# EAGLE design MONSTR_V0.2 (EAGLE 6.5.0)
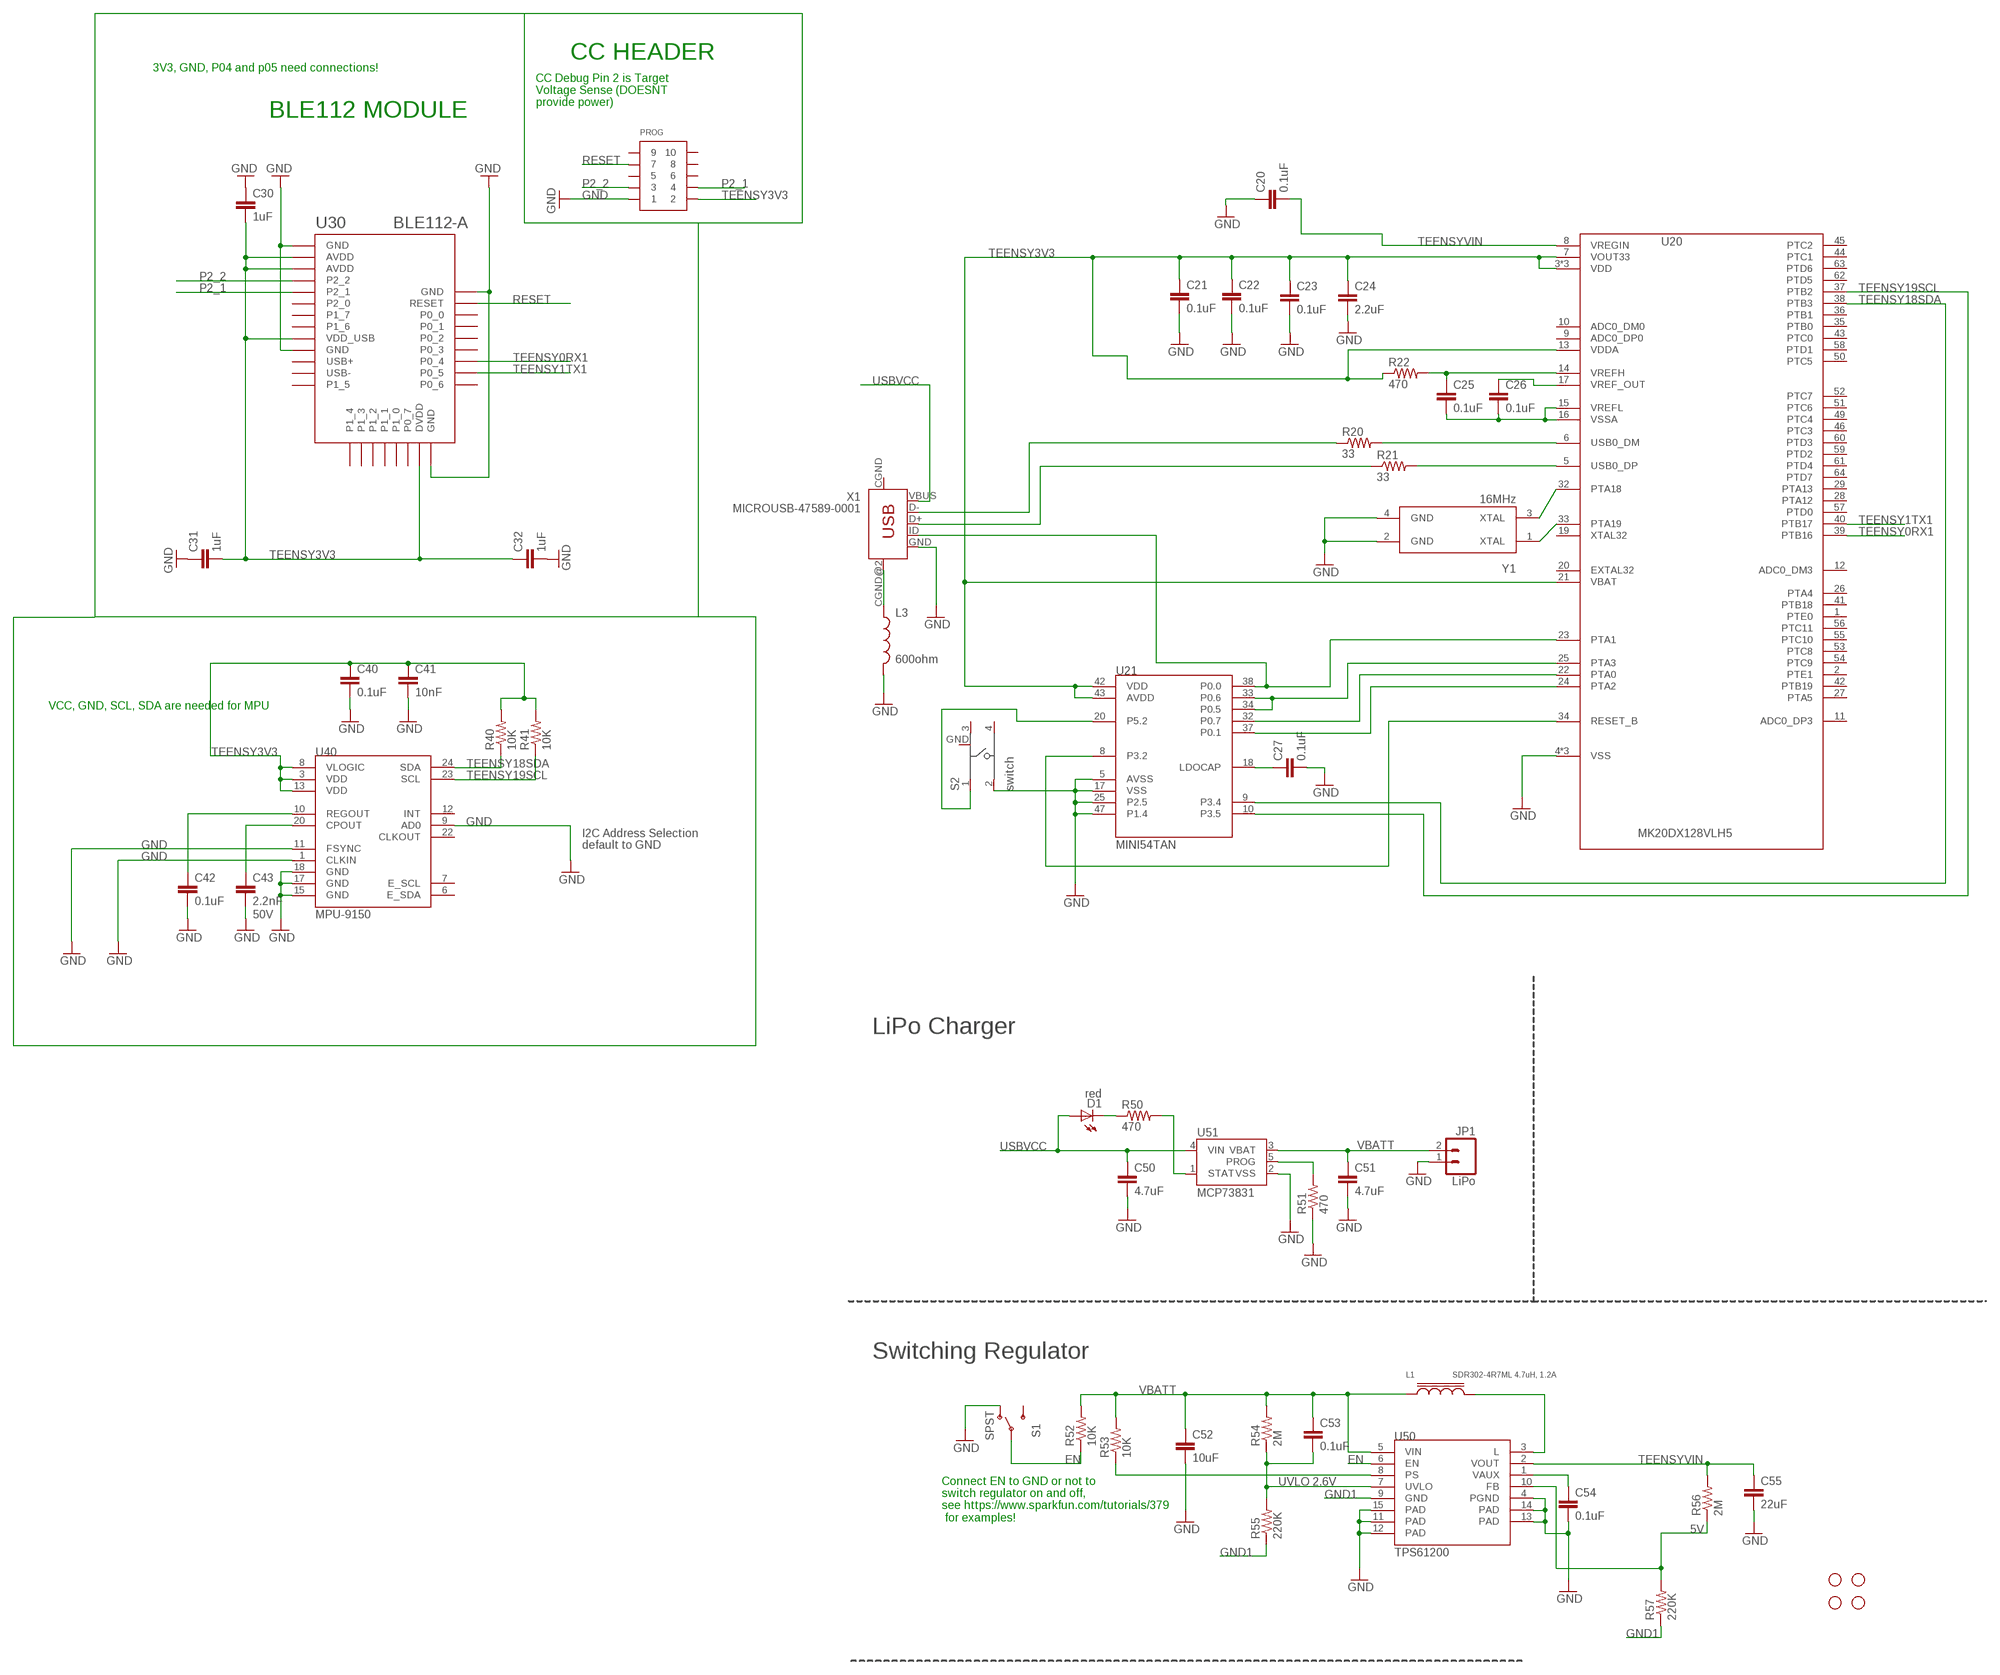
[diagram p0: schematic, sheet 1]

## Parts
C20  0.1uF  CAP0402-CAP  [0402-CAP]
C21  0.1uF  CAP0402-CAP  [0402-CAP]
C22  0.1uF  CAP0402-CAP  [0402-CAP]
C23  0.1uF  CAP0402-CAP  [0402-CAP]
C24  2.2uF  CAP0402-CAP  [0402-CAP]
C25  0.1uF  CAP0402-CAP  [0402-CAP]
C26  0.1uF  CAP0402-CAP  [0402-CAP]
C27  0.1uF  CAP0402-CAP  [0402-CAP]
C30  1uF  CAP0402-CAP  [0402-CAP]
C31  1uF  CAP0402-CAP  [0402-CAP]
C32  1uF  CAP0402-CAP  [0402-CAP]
C40  0.1uF  CAP0402-CAP  [0402-CAP]
C41  10nF  CAP0402-CAP  [0402-CAP]
C42  0.1uF  CAP0402-CAP  [0402-CAP]
C43  2.2nF  CAP0402-CAP  [0402-CAP]
C50  4.7uF  CAP0402-CAP  [0402-CAP]
C51  4.7uF  CAP0402-CAP  [0402-CAP]
C52  10uF  CAP0402-CAP  [0402-CAP]
C53  0.1uF  CAP0402-CAP  [0402-CAP]
C54  0.1uF  CAP0402-CAP  [0402-CAP]
C55  22uF  CAP0603-CAP  [0603-CAP]
D1  red  LED0603  [LED-0603]
JP1  LiPo  M02-JST-2MM-SMT  [JST-2-SMD]
JP7  STAND-OFF  [STAND-OFF]
JP8  STAND-OFF  [STAND-OFF]
JP9  STAND-OFF  [STAND-OFF]
JP10  STAND-OFF  [STAND-OFF]
L1  SDR302-4R7ML 4.7uH, 1.2A  BOURNE-SDR302-SERIES-INDUCTOR  [BOURNS-SDR0302-SERIES-INDUCTOR]
L3  600ohm  INDUCTOR0805  [0805]
PROG  CONN_5-2-FTSH-V  [FTSH-105-DV]
R20  33  RESISTOR0402-RES  [0402-RES]
R21  33  RESISTOR0402-RES  [0402-RES]
R22  470  RESISTOR0402-RES  [0402-RES]
R40  10K  RESISTOR0402-RES  [0402-RES]
R41  10K  RESISTOR0402-RES  [0402-RES]
R50  470  RESISTOR0402-RES  [0402-RES]
R51  470  RESISTOR0402-RES  [0402-RES]
R52  10K  RESISTOR0402-RES  [0402-RES]
R53  10K  RESISTOR0402-RES  [0402-RES]
R54  2M  RESISTOR0402-RES  [0402-RES]
R55  220K  RESISTOR0402-RES  [0402-RES]
R56  2M  RESISTOR0402-RES  [0402-RES]
R57  220K  RESISTOR0402-RES  [0402-RES]
S1  SPST  SWITCH-SPDT-SMD-A  [SWITCH-SPST-SMD-A]
S2  switch  101-IG  [101-IG]
U20  MK20DX128VLH5  [MK20DX128VLH5]
U21  MINI54TAN  [MINI54TAN]
U30  BLE112-A  BLE112-A-VISUAL  [BLE112-A]
U40  MPU-9150  MPU-9150QFN-24-NP  [QFN-24-NP]
U50  TPS61200  [QFN-10_PAD]
U51  MCP73831  [SOT23-5]
X1  MICROUSB-47589-0001  [MICROUSB-47589-0001]
Y1  16MHz  NX3225SA  [CRYSTAL-SMD-3.2_2.5MM]

## Nets
5V: R56.1 R57.2 U50.10(FB)
EN: R52.1 S1.2(P) U50.6(EN)
GND: C20.1 C21.2 C22.2 C23.2 C24.2 C27.2 C30.1 C31.1 C32.2 C40.2 C41.2 C42.2 C43.2 C50.2 C51.2 C52.2 C54.2 C55.2 JP1.1 L3.2 PROG.1 R51.1 S1.1(O) S2.2 U20.4(VSS) U20.31(VSS) U20.47(VSS) U21.5(AVSS) U21.17(VSS) U21.25(P2.5) U21.47(P1.4) U30.GND1(GND) U30.GND2(GND) U30.GND3(GND) U30.GND4(GND) U40.1(CLKIN) U40.9(AD0) U40.11(FSYNC) U40.15(GND) U40.17(GND) U40.18(GND) U50.4(PGND) U50.11(PAD) U50.12(PAD) U50.13(PAD) U50.14(PAD) U50.15(PAD) U51.2(VSS) X1.GND Y1.2(GND) Y1.4(GND)
GND1: R55.1 R57.1 U50.9(GND)
N$1: C43.1 U40.20(CPOUT)
N$2: C42.1 U40.10(REGOUT)
N$4: R53.1 U50.8(PS)
N$5: R51.2 U51.5(PROG)
N$6: R50.2 U51.1(STAT)
N$7: U20.32(PTA18) Y1.3(XTAL)
N$8: U20.33(PTA19) Y1.1(XTAL)
N$15: C25.2 C26.2 U20.15(VREFL) U20.16(VSSA)
N$16: R20.2 U20.6(USB0_DM)
N$17: R21.2 U20.5(USB0_DP)
N$18: R20.1 X1.D-
N$19: R21.1 X1.D+
N$20: L3.1 X1.CGND@2(MTN4)
N$21: C26.1 U20.17(VREF_OUT)
N$22: C25.1 R22.2 U20.14(VREFH)
N$26: U20.23(PTA1) U21.38(P0.0) X1.ID
N$27: U20.25(PTA3) U21.33(P0.6) U21.34(P0.5)
N$28: U20.22(PTA0) U21.32(P0.7)
N$29: U20.24(PTA2) U21.37(P0.1)
N$32: S2.1 U21.20(P5.2)
N$33: U20.34(RESET_B) U21.8(P3.2)
N$54: C27.1 U21.18(LDOCAP)
N$56: D1.C R50.1
N$57: L1.2 U50.3(L)
N$58: C54.1 U50.1(VAUX)
P2_1: PROG.4 U30.P2_1
P2_2: PROG.3 U30.P2_2
RESET: PROG.7 U30.RESET
TEENSY0RX1: U20.39(PTB16) U30.P0_4
TEENSY1TX1: U20.40(PTB17) U30.P0_5
TEENSY3V3 [power]: C21.1 C22.1 C23.1 C24.1 C30.2 C31.2 C32.1 C40.1 C41.1 PROG.2 R22.1 R40.2 R41.2 U20.3(VDD) U20.7(VOUT33) U20.13(VDDA) U20.21(VBAT) U20.30(VDD) U20.48(VDD) U21.42(VDD) U21.43(AVDD) U30.AVDD1(AVDD) U30.AVDD2(AVDD) U30.DVDD U30.VDD_USB U40.3(VDD) U40.8(VLOGIC) U40.13(VDD)
TEENSY18SDA: R40.1 U20.38(PTB3) U21.9(P3.4) U40.24(SDA)
TEENSY19SCL: R41.1 U20.37(PTB2) U21.10(P3.5) U40.23(SCL)
TEENSYVIN: C20.2 C55.1 R56.2 U20.8(VREGIN) U50.2(VOUT)
USBVCC: C50.1 D1.A U51.4(VIN) X1.VBUS
UVLO: C53.2 R54.1 R55.2 U50.7(UVLO)
VBATT: C51.1 C52.1 C53.1 JP1.2 L1.1 R52.2 R53.2 R54.2 U50.5(VIN) U51.3(VBAT)
Unconnected: PROG.5 PROG.6 PROG.8 PROG.9 PROG.10 S1.3(S) S2.3 S2.4 U20.1(PTE0) U20.2(PTE1) U20.9(ADC0_DP0) U20.10(ADC0_DM0) U20.11(ADC0_DP3) U20.12(ADC0_DM3) U20.19(XTAL32) U20.20(EXTAL32) U20.26(PTA4) U20.27(PTA5) U20.28(PTA12) U20.29(PTA13) U20.35(PTB0) U20.36(PTB1) U20.41(PTB18) U20.42(PTB19) U20.43(PTC0) U20.44(PTC1) U20.45(PTC2) U20.46(PTC3) U20.49(PTC4) U20.50(PTC5) U20.51(PTC6) U20.52(PTC7) U20.53(PTC8) U20.54(PTC9) U20.55(PTC10) U20.56(PTC11) U20.57(PTD0) U20.58(PTD1) U20.59(PTD2) U20.60(PTD3) U20.61(PTD4) U20.62(PTD5) U20.63(PTD6) U20.64(PTD7) U30.P0_0 U30.P0_1 U30.P0_2 U30.P0_3 U30.P0_6 U30.P0_7 U30.P1_0 U30.P1_1 U30.P1_2 U30.P1_3 U30.P1_4 U30.P1_5 U30.P1_6 U30.P1_7 U30.P2_0 U30.USB+ U30.USB- U40.6(E_SDA) U40.7(E_SCL) U40.12(INT) U40.22(CLKOUT) X1.CGND(MTN2)

## Notes on the sheet
- CC HEADER
- 3V3, GND, P04 and p05 need connections!
- CC Debug Pin 2 is Target
  Voltage Sense (DOESNT
  provide power)
- BLE112 MODULE
- VCC, GND, SCL, SDA are needed for MPU
- I2C Address Selection
- default to GND
- 50V
- LiPo Charger
- Switching Regulator
- UVLO 2.6V
- Connect EN to GND or not to 
  switch regulator on and off, 
  see https://www.sparkfun.com/tutorials/379
   for examples!

## Power pins joined to a net without a drawn wire
GND: S2.GND

## Library data of the parts
C20-C27 C30-C32 C40-C43 C50-C55 = SparkFun-Capacitors:CAP: Capacitor Standard 0603 ceramic capacitor, and 0.1" leaded capacitor.
D1 = SparkFun-LED:LED: LEDs Standard schematic elements and footprints for 5mm, 3mm, 1206, and 0603 sized LEDs. 5mm - Spark Fun Electronics SKU : COM-00529 (and others)
JP1 = SparkFun:M02: Header 2 Standard 2-pin 0.1" header. Use with straight break away headers (SKU : PRT-00116), right angle break away headers (PRT-00553), swiss pins (PRT-00743), machine pins (PRT-00117), and female headers (PRT-00115). Molex polarized connector foot print use with SKU : PRT-08233 with associated crimp pins and housings.
JP7-JP10 = SparkFun:STAND-OFF: Stand Off This is the mechanical footprint for a #4 phillips button head screw. Use the keepout ring to avoid running the screw head into surrounding components. SKU : PRT-00447
L1 = BenLibrary:BOURNE-SDR302-SERIES-INDUCTOR: Bourne SDR0302 Series ferrite-core inductor http://www.digikey.com/product-detail/en/SDR0302-4R7ML/SDR0302-4R7MLCT-ND/2127073
L3 = SparkFun-Passives:INDUCTOR: Inductors Basic Inductor/Choke - 0603 and 1206. Footprints are not proven and vary greatly between part numbers. SRN6045- 33uH, 20% 1.4A SDR0403-560KL - 56uH, 10%, 500mA RMS/740mA peak
PROG = pel_misc:CONN_5-2
R20-R22 R40 R41 R50-R57 = SparkFun-Passives:RESISTOR: Resistor Basic schematic elements and footprints for 0603, 1206, and PTH resistors.
S1 = SparkFun-Electromechanical:SWITCH-SPDT: SPDT Switch Simple slide switch, Spark Fun Electronics SKU : COM-00102 DPDT SMT slide switch, AYZ0202, SWCH-08179
S2 = BLE112 Breakout Board v2.1-non-prefixed:101-IG
U20 = TeensyCustom:MK20DX128VLH5: Teensy 3.0 Processing Unit - MK20DX128VLH5 ARM Cortex M0 Datasheet: http://cache.freescale.com/files/32bit/doc/data_sheet/K20P64M50SF0.pdf
U21 = TeensyCustom:MINI54TAN: MINI54TAN Bootloader from PJRC.com, preprogrammed with Teensy 3.0 bootloader. https://www.pjrc.com/store/ic_mini54_tqfp.html
U30 = sf-bluegiga:BLE112-A-VISUAL: Bluetooth Low Energy single-mode module - Bluetooth 4.0, chip antenna
U40 = SparkFun-Sensors:MPU-9150: 9DOF (3mag, 3accel, 3rotat). I2C interface.
U50 = SparkFun:TPS61200: DC to DC Booster
U51 = SparkFun:MCP73831: Microchip's MCP73831 Miniature single cell, fully integrated Li-Ion, Li-polymer charge management controller http://ww1.microchip.com/downloads/en/DeviceDoc/21984a.pdf
X1 = BLE112 Breakout Board v2.1-non-prefixed:MICROUSB-47589-0001
Y1 = BenLibrary:NX3225SA: 16MHz, 10PF SMD Crystal, NX3225SA http://www.digikey.com/product-detail/en/NX3225SA-16.000000MHZ-T1/644-1100-2-ND

## Net classes
1 power: width 0.254 mm, drill 0.33 mm, clearance 0.152 mm

## Board
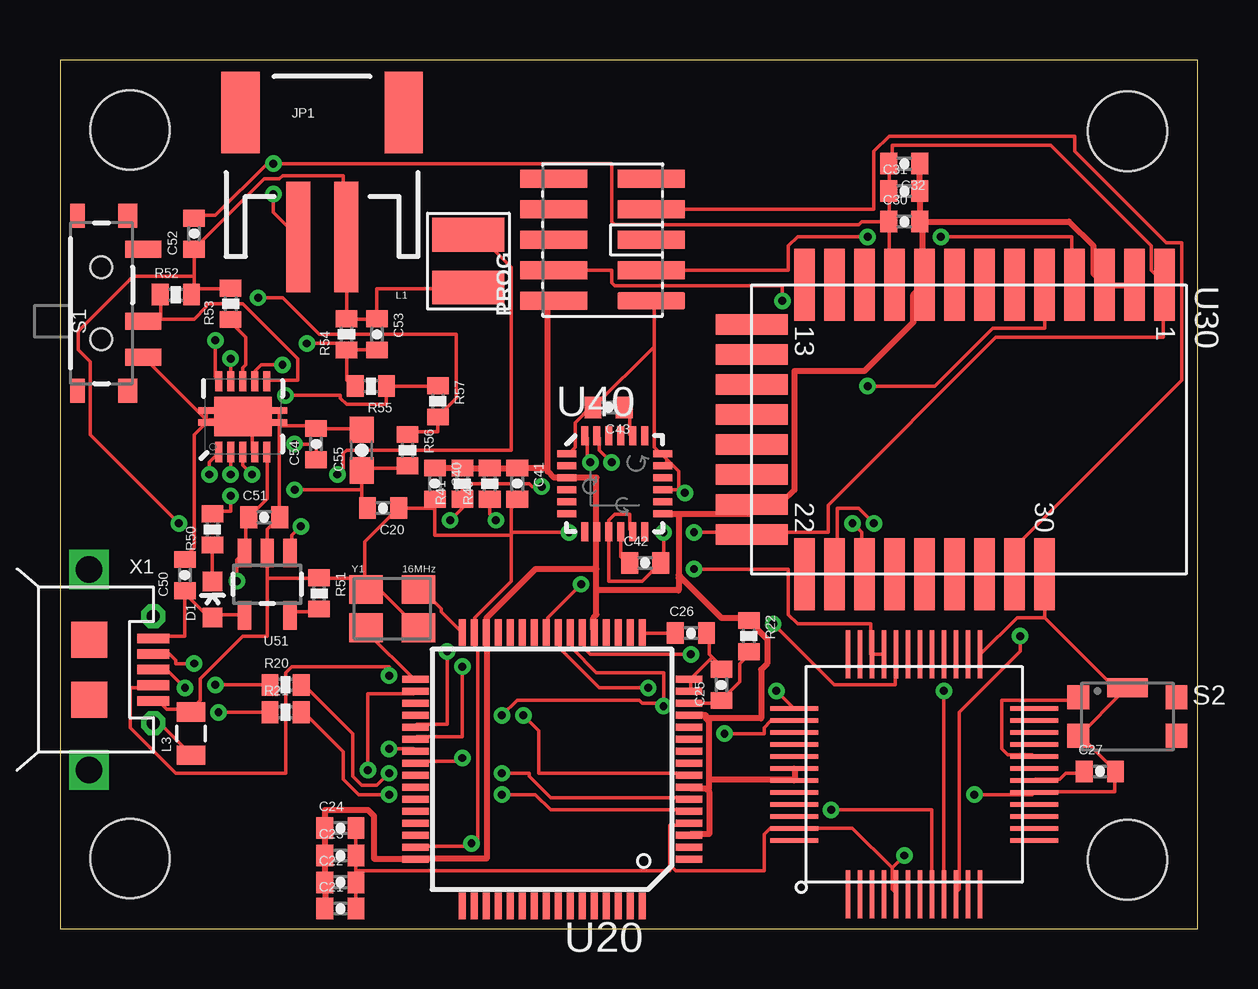
[diagram p1: board, top side]
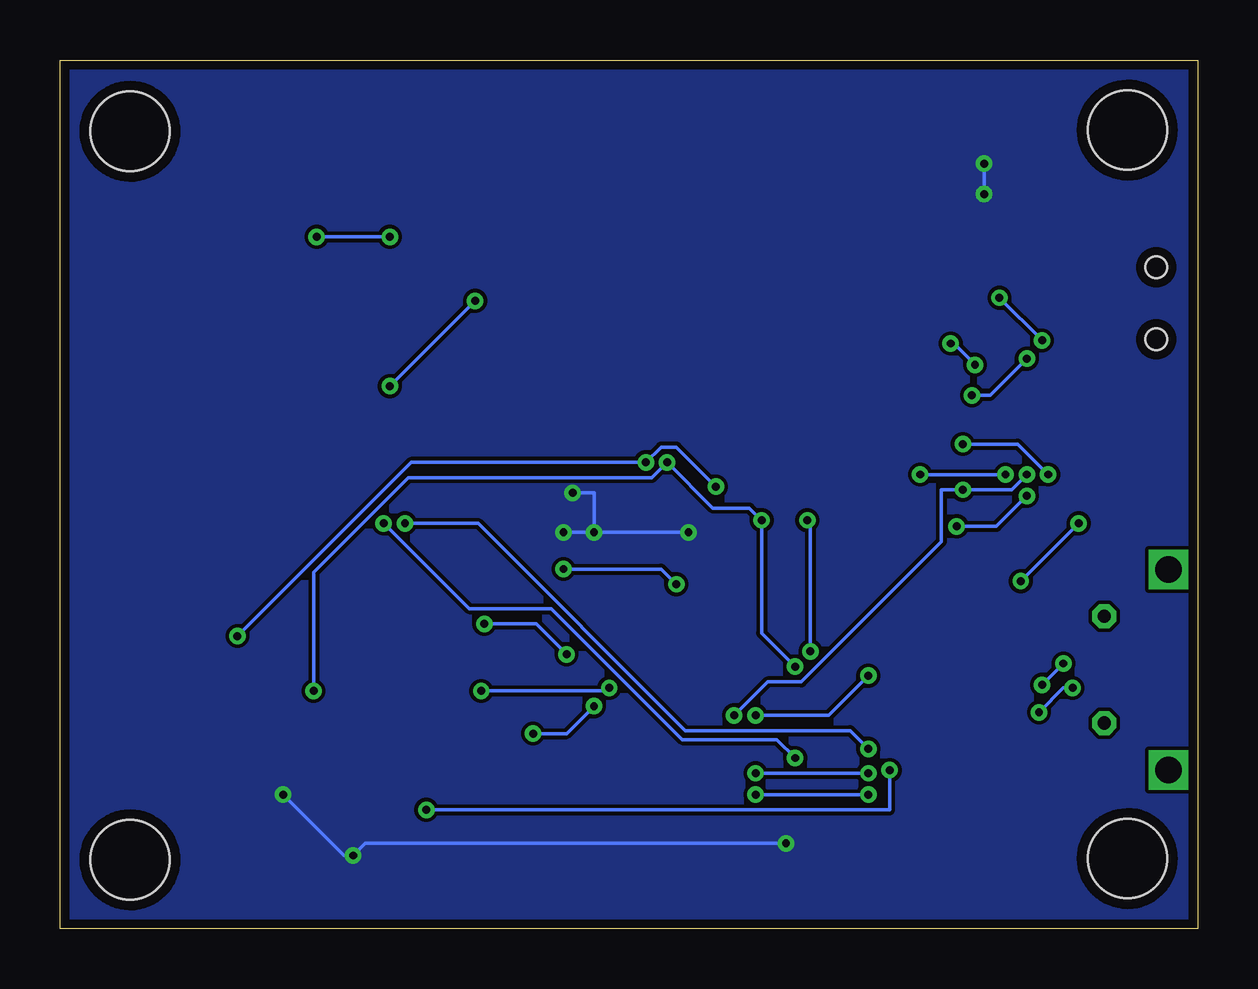
[diagram p2: board, bottom side, seen from below]

Size 47.4 x 36.2 mm. Coordinates in mm from the lower left corner, seen from the top.
Outline: 0,0 47.4,0 47.4,36.2 0,36.2 0,0
Copper layers (1*16): Top 0.0356mm / dielectric 1.5011mm / Bottom 0.0356mm
Design rules "LaenPCBOrder": minimum track width 6mil, minimum drill 13mil, track to track 6mil, track to pad 6mil, pad to pad 6mil, via to via 6mil, smd to smd 6mil, copper to edge 15mil, drill to drill 6mil, minimum pad ring 7mil, minimum via ring 7mil, stop-mask expansion 4mil, vias tented up to drill 0mil, thermal gap 10mil

### Footprints (pad centres in the part's own frame; a part is rotated, then mirrored left to right if it is on the bottom)
0402-CAP = smd 0.7 x 0.9: 1 -0.65,0; 2 0.65,0
0603-CAP = smd 1.1 x 1: 1 -0.85,0; 2 0.85,0
LED-0603 = smd 0.8 x 0.8: A 0,-0.75; C 0,0.75
JST-2-SMD = smd 1 x 4.6: 1 -1,-3.7; 2 1,-3.7 | smd 1.6 x 3.4: NC1 -3.4,1.5; NC2 3.4,1.5
STAND-OFF = hole 3.302: 0,0
BOURNS-SDR0302-SERIES-INDUCTOR = smd 3 x 1.4: 1 0,1.1; 2 0,-1.1
0805 = smd 0.8 x 1.2: 1 -0.9,0; 2 0.9,0
FTSH-105-DV = smd 0.74 x 2.8: 1 -2.54,-2.03; 2 -2.54,2.03; 3 -1.27,-2.03; 4 -1.27,2.03; 5 0,-2.03; 6 0,2.03; 7 1.27,-2.03; 8 1.27,2.03; 9 2.54,-2.03; 10 2.54,2.03
0402-RES = smd 0.7 x 0.9: 1 -0.65,0; 2 0.65,0
SWITCH-SPST-SMD-A = smd 0.7 x 1.5: 1 -2.25,-1.75; 2 -0.75,-1.75; 3 2.25,-1.75 | smd 1 x 0.6: GND1 -3.65,1; GND3 3.65,1 | smd 1 x 0.8: GND2 -3.65,-1.1; GND4 3.65,-1.1 | hole 0.9: -1.5,0; 1.5,0
101-IG = smd 0.9 x 1: 1 -2.05,0.8; 2 -2.05,-0.8; 3 2.05,0.8; 4 2.05,-0.8 | smd 1.7 x 0.8: GND 0,1.2
MK20DX128VLH5 = smd 1.1 x 0.285: 1 -5.605,3.385; 2 -5.605,2.885; 3 -5.605,2.385; 4 -5.605,1.885; 5 -5.605,1.385; 6 -5.605,0.885; 7 -5.605,0.385; 8 -5.605,-0.115; 9 -5.605,-0.615; 10 -5.605,-1.115; 11 -5.605,-1.615; 12 -5.605,-2.115; 13 -5.605,-2.615; 14 -5.605,-3.115; 15 -5.605,-3.615; 16 -5.605,-4.115; 33 5.795,-4.115; 34 5.795,-3.615; 35 5.795,-3.115; 36 5.795,-2.615; 37 5.795,-2.115; 38 5.795,-1.615; 39 5.795,-1.115; 40 5.795,-0.615; 41 5.795,-0.115; 42 5.795,0.385; 43 5.795,0.885; 44 5.795,1.385; 45 5.795,1.885; 46 5.795,2.385; 47 5.795,2.885; 48 5.795,3.385 | smd 0.285 x 1.1: 17 -3.655,-6.065; 18 -3.155,-6.065; 19 -2.655,-6.065; 20 -2.155,-6.065; 21 -1.655,-6.065; 22 -1.155,-6.065; 23 -0.655,-6.065; 24 -0.155,-6.065; 25 0.345,-6.065; 26 0.845,-6.065; 27 1.345,-6.065; 28 1.845,-6.065; 29 2.345,-6.065; 30 2.845,-6.065; 31 3.345,-6.065; 32 3.845,-6.065; 49 3.845,5.335; 50 3.345,5.335; 51 2.845,5.335; 52 2.345,5.335; 53 1.845,5.335; 54 1.345,5.335; 55 0.845,5.335; 56 0.345,5.335; 57 -0.155,5.335; 58 -0.655,5.335; 59 -1.155,5.335; 60 -1.655,5.335; 61 -2.155,5.335; 62 -2.655,5.335; 63 -3.155,5.335; 64 -3.655,5.335
MINI54TAN = smd 0.2 x 2: 1 -2.75,-5; 2 -2.25,-5; 3 -1.75,-5; 4 -1.25,-5; 5 -0.75,-5; 6 -0.25,-5; 7 0.25,-5; 8 0.75,-5; 9 1.25,-5; 10 1.75,-5; 11 2.25,-5; 12 2.75,-5; 25 2.75,5; 26 2.25,5; 27 1.75,5; 28 1.25,5; 29 0.75,5; 30 0.25,5; 31 -0.25,5; 32 -0.75,5; 33 -1.25,5; 34 -1.75,5; 35 -2.25,5; 36 -2.75,5 | smd 2 x 0.2: 13 5,-2.75; 14 5,-2.25; 15 5,-1.75; 16 5,-1.25; 17 5,-0.75; 18 5,-0.25; 19 5,0.25; 20 5,0.75; 21 5,1.25; 22 5,1.75; 23 5,2.25; 24 5,2.75; 37 -5,2.75; 38 -5,2.25; 39 -5,1.75; 40 -5,1.25; 41 -5,0.75; 42 -5,0.25; 43 -5,-0.25; 44 -5,-0.75; 45 -5,-1.25; 46 -5,-1.75; 47 -5,-2.25; 48 -5,-2.75
BLE112-A = smd 3 x 0.85: AVDD1 -6.05,6.9; AVDD2 -6.05,5.65; GND1 -6.05,8.15; GND2 -6.05,-3.1; GND4 6,3.15; P0_0 6,0.65; P0_1 6,-0.6; P0_2 6,-1.85; P0_3 6,-3.1; P0_4 6,-4.35; P0_5 6,-5.6; P0_6 6,-6.85; P1_5 -6.05,-6.85; P1_6 -6.05,-0.6; P1_7 -6.05,0.65; P2_0 -6.05,1.9; P2_1 -6.05,3.15; P2_2 -6.05,4.4; RESET 6,1.9; USB+ -6.05,-4.35; USB- -6.05,-5.6; VDD_USB -6.05,-1.85 | smd 0.85 x 3: DVDD 3.1,-9.05; GND3 4.35,-9.05; P0_7 1.85,-9.05; P1_0 0.6,-9.05; P1_1 -0.65,-9.05; P1_2 -1.9,-9.05; P1_3 -3.15,-9.05; P1_4 -4.4,-9.05
QFN-24-NP = smd 0.8 x 0.3: 1 -2,1.25; 2 -2,0.75; 3 -2,0.25; 4 -2,-0.25; 5 -2,-0.75; 6 -2,-1.25; 13 2,-1.25; 14 2,-0.75; 15 2,-0.25; 16 2,0.25; 17 2,0.75; 18 2,1.25 | smd 0.3 x 0.8: 7 -1.25,-2; 8 -0.75,-2; 9 -0.25,-2; 10 0.25,-2; 11 0.75,-2; 12 1.25,-2; 19 1.25,2; 20 0.75,2; 21 0.25,2; 22 -0.25,2; 23 -0.75,2; 24 -1.25,2
QFN-10_PAD = smd 0.297 x 0.85: 1 -1,-1.475; 2 -0.5,-1.475; 3 0,-1.475; 4 0.5,-1.475; 5 1,-1.475; 6 1,1.475; 7 0.5,1.475; 8 0,1.475; 9 -0.5,1.475; 10 -1,1.475 | smd 0.7 x 0.28: 11 -1.5,0.25; 12 -1.5,-0.25; 13 1.5,0.25; 14 1.5,-0.25 | smd 2.4 x 1.65: 15 0,0
SOT23-5 = smd 0.55 x 1.2: 1 -0.95,-1.3; 2 0,-1.3; 3 0.95,-1.3; 4 0.95,1.3; 5 -0.95,1.3
MICROUSB-47589-0001 = drill 0.55 pad 1 octagon: CGND 0,2.225; CGND@2 0,-2.225 | drill 1.1 pad 1.6 square: CGND@3 -2.675,-4.175; CGND@4 -2.675,4.175 | smd 1.5 x 1.5: CGND@5 -2.675,1.25; CGND@6 -2.675,-1.25 | smd 1.35 x 0.4: D+ 0,0; D- 0,0.65; GND 0,-1.3; ID 0,-0.65; VBUS 0,1.3
CRYSTAL-SMD-3.2_2.5MM = smd 1.4 x 1.2: 1 -1.1,-0.8; 2 1.1,-0.8; 3 1.1,0.8; 4 -1.1,0.8

### Placement (x,y rotation side)
C20  13.46,17.53 180 top
C21  11.68,0.84 0 top
C22  11.68,1.93 0 top
C23  11.68,3.05 0 top
C24  11.68,4.19 0 top
C25  27.56,10.16 90 top
C26  26.29,12.32 0 top
C27  43.33,6.55 0 top
C30  35.18,29.46 0 top
C31  35.18,30.73 0 top
C32  35.18,31.88 180 top
C40  15.62,18.54 270 top
C41  19.05,18.54 270 top
C42  24.38,15.24 0 top
C43  22.86,21.72 180 top
C50  5.21,14.73 90 top
C51  8.51,17.14 0 top
C52  5.59,28.96 90 top
C53  13.21,24.77 270 top
C54  10.67,20.19 90 top
C55  12.57,19.94 90 top
D1  6.35,13.72 0 top
JP1  10.92,32.51 0 top
JP7  44.48,2.87 0 top
JP8  44.48,33.22 0 top
JP9  2.92,33.27 0 top
JP10  2.92,2.92 0 top
L1  17.02,27.81 180 top
L3  5.46,8.13 90 top
PROG  22.61,28.7 90 top
R20  9.4,10.16 0 top
R21  9.4,9.02 0 top
R22  28.7,12.19 270 top
R40  17.91,18.54 90 top
R41  16.76,18.54 90 top
R50  6.35,16.64 90 top
R51  10.79,13.97 270 top
R52  4.83,26.42 0 top
R53  7.11,26.04 90 top
R54  11.94,24.77 90 top
R55  12.95,22.61 180 top
R56  14.48,19.94 270 top
R57  15.75,21.97 270 top
S1  1.73,26.06 90 top
S2  44.48,8.84 0 top
U20  20.6,6.27 180 top
U21  35.59,6.43 0 top
U30  37.87,20.78 270 top
U40  23.11,18.54 0 top
U50  7.62,21.34 0 top
U51  8.64,14.35 180 top
X1  3.89,10.79 0 top
Y1  13.84,13.34 0 top

### Tracks (layer width: path | path; a pad name or v marks a point on that pad's centre or on a via)
5V  (via drill 0.33)
  Top 0.152: v6.48,24.51 6.48,22.99 6.6,22.86 U50.10 | v8.26,26.29 9.27,26.29 10.79,24.77 16.51,24.77 16.51,22.1 15.75,21.34 R57.2 15.75,20.7 14.48,20.7 R56.1
  Bottom 0.152: v8.26,26.29 v6.48,24.51
EN
  Top 0.152: 4.19,25.4 3.56,25.4 S1.2 4.19,25.4 | 4.19,25.4 5.59,25.4 6.1,25.91 6.1,26.04 7.62,26.04 9.91,23.75 9.91,22.86 8.64,22.86 U50.6 | 4.19,25.4 R52.1
GND  (via drill 0.33)
  Top 0.152: 41.02,12.95 39.88,12.95 38.35,11.43 U21.25 | 41.02,12.95 41.02,14.73 U30.GND4 | 44.2,9.78 42.55,8.13 S2.2 42.55,8 43.94,6.6 C27.2 43.94,6.48 43.94,5.71 40.64,5.71 U21.17 40.51,5.59 v38.1,5.59 | 44.2,9.78 44.45,10.03 S2.GND 44.2,9.78 | 44.2,9.78 41.02,12.95 | C21.2 12.32,0.89 12.32,1.91 C22.2 12.32,2.03 12.32,2.41 | 12.32,2.41 C23.2 | C23.2 C24.2 | C23.2 | 25.4,2.67 25.4,4.32 26.16,4.32 U20.4 | 25.4,2.67 25.65,2.41 29.34,2.41 29.34,3.94 29.59,4.19 30.48,4.19 U21.47 30.61,4.19 33.02,4.19 34.67,2.54 | 34.67,2.54 34.67,1.65 34.8,1.52 U21.5 | 12.32,2.41 25.4,2.41 25.4,2.67 | 34.67,2.54 v35.18,3.05 | 18.8,16.38 18.8,14.48 17.27,12.95 17.27,12.45 U20.31 17.27,12.32 17.27,11.68 17.4,11.56 17.4,3.43 17.14,3.43 | 18.8,16.38 18.8,16.51 | 18.8,16.51 18.8,17.53 19.05,17.78 C41.2 | 17.14,3.43 14.86,3.43 U20.47 | 15.62,17.53 C20.1 14.1,17.53 12.7,16.13 12.7,14.61 | C40.2 15.62,17.53 | 12.7,14.61 10.79,14.61 | 12.7,14.61 12.7,14.22 Y1.4 | Y1.2 14.86,12.57 13.34,14.1 12.83,14.1 Y1.4 | 12.7,14.61 Y1.4 | 5.46,9.14 4.45,9.14 4.19,9.4 3.94,9.4 X1.GND | 9.14,17.14 8.64,16.64 U51.2 8.64,14.61 | U50.14 9.14,21.21 9.14,21.46 U50.13 | 6.1,21.21 6.1,21.46 U50.11 | 7.87,21.08 8,20.95 8,19.94 U50.4 | U50.12 6.22,21.21 7.62,21.21 U50.15 7.87,21.08 | 7.87,21.08 9.02,21.08 U50.14 | C50.2 5.21,15.49 5.59,15.88 5.59,20.57 6.1,21.08 U50.12 | 9.14,20.95 10.67,20.95 C54.2 10.67,20.83 12.57,20.83 C55.2 | 9.14,20.95 9.14,21.08 U50.14 | 6.1,21.21 3.56,23.75 S1.1 | 6.1,21.21 U50.12 | 9.14,20.95 9.14,17.14 | 9.14,17.14 C51.2 | 9.14,20.95 U50.14 | 5.46,9.14 5.84,9.53 5.84,10.41 7.62,12.19 8.64,12.19 8.64,14.61 | 5.46,9.14 L3.2 | 8.64,14.61 10.79,14.61
  Top 0.152: 10.79,14.61 R51.1 | 18.8,16.38 15.62,16.38 15.62,17.53 | U40.11 23.75,16.64 23.75,17.27 23.11,17.27 22.86,17.02 22.86,16.64 U40.9 22.86,16.51 22.86,14.48 24.26,14.48 25.02,15.24 C42.2 25.15,15.24 v25.15,16.51 | U40.1 21.21,19.81 21.46,20.07 21.46,21.08 22.1,21.72 C43.2 22.23,21.72 24.77,24.26 | 25.78,18.41 25.78,19.05 25.27,19.56 | 25.78,18.41 25.78,18.29 25.15,18.29 U40.15 | 25.27,19.56 25.15,19.68 U40.18 25.02,19.81 24.77,20.07 24.77,24.26 | 25.27,19.56 25.27,19.43 25.15,19.3 U40.17 | 24.77,24.26 24.77,26.04 PROG.1 | 25.78,18.41 v26.04,18.16 | v26.42,16.51 28.7,16.51 U30.GND3 28.83,16.51 32,16.51 32,17.65 38.99,24.64 45.97,24.64 45.97,26.8 U30.GND1 45.97,26.92 45.47,27.43 45.47,28.45 41.27,32.64 34.67,32.64 34.67,32 34.54,31.88 | 34.54,30.73 34.54,29.46 | C52.2 5.59,29.72 6.48,29.72 8.64,31.88 v8.89,31.88 22.99,31.88 22.99,29.46 23.11,29.34 33.27,29.34 33.4,29.46 C30.1 34.54,29.46 | 34.54,30.73 34.54,31.88 | 34.54,30.73 C31.1 | 34.54,29.46 34.54,27.05 34.67,26.92 U30.GND2 | v8.89,30.61 8.89,29.84 9.91,28.83 JP1.1 | 34.54,31.88 C32.2 | v21.21,16.51 18.8,16.51 | 17.14,3.43 v17.14,3.56
  Bottom 0.152: v38.1,5.59 35.56,3.05 v35.18,3.05 34.67,3.56 v17.14,3.56 | v25.15,16.51 25.15,18.16 v26.04,18.16 | v25.15,16.51 v26.42,16.51 | v8.89,31.88 v8.89,30.61 | v25.15,16.51 v21.21,16.51
  pour Bottom (isolate 0.152, rank 6): 0.38,36.2 47.02,36.2 47.02,0.38 0.38,0.38
GND1  (via drill 0.33)
  Top 0.152: v7.11,23.75 7.11,22.86 U50.9 | v9.4,22.23 11.68,22.23 11.68,22.1 11.94,21.84 13.59,21.84 R55.1 15.75,22.61 R57.1
  Bottom 0.152: v7.11,23.75 8.64,22.23 v9.4,22.23
N$1
  Top 0.152: U40.20 23.75,20.57 23.75,21.59 23.62,21.72 C43.1
N$2
  Top 0.152: U40.10 23.37,16.51 23.37,15.49 23.62,15.24 C42.1
N$4
  Top 0.152: U50.8 7.62,23.37 7.75,23.5 7.75,24.64 7.11,25.27 R53.1
N$5
  Top 0.152: R51.2 10.79,13.21 9.65,13.21 9.65,13.08 U51.5
N$6  (via drill 0.33)
  Top 0.152: v7.11,18.03 7.11,17.4 6.35,17.4 R50.2 | v10.03,16.76 9.65,16.38 9.65,15.75 U51.1
  Bottom 0.152: v7.11,18.03 8.38,16.76 v10.03,16.76
N$7
  Top 0.152: U20.32 16.64,12.45 15.88,13.21 15.88,13.34 14.99,14.22 Y1.3
N$8
  Top 0.152: U20.33 14.73,10.41 12.83,12.32 12.83,12.45 Y1.1
N$15
  Top 0.152: U20.15 26.29,9.91 26.29,10.29 U20.16 26.29,10.41 27.18,11.3 | 27.18,11.3 27.05,11.43 27.05,12.32 C26.2 | 27.18,11.3 27.56,10.92 C25.2
N$16  (via drill 0.33)
  Top 0.152: v13.72,6.48 13.21,5.97 12.57,5.97 12.19,6.35 12.19,8.13 10.16,10.16 R20.2 | v18.41,6.48 19.56,6.48 19.56,6.35 20.45,5.46 26.16,5.46 U20.6
  Bottom 0.152: v18.41,6.48 v13.72,6.48
N$17  (via drill 0.33)
  Top 0.152: v13.72,5.59 12.45,5.59 11.81,6.22 11.81,7.37 10.16,9.02 R21.2 | v18.41,5.59 19.81,5.59 20.45,4.95 26.16,4.95 U20.5
  Bottom 0.152: v18.41,5.59 v13.72,5.59
N$18  (via drill 0.33)
  Top 0.152: v6.48,10.16 R20.1 | v5.59,11.05 4.83,11.05 4.83,11.18 4.57,11.43 3.94,11.43 X1.D-
  Bottom 0.152: v5.59,11.05 v6.48,10.16
N$19  (via drill 0.33)
  Top 0.152: v6.6,9.02 R21.1 | v5.21,10.03 4.45,10.79 X1.D+
  Bottom 0.152: v6.6,9.02 5.59,10.03 v5.21,10.03
N$20
  Top 0.152: L3.1 4.19,8.51 3.94,8.51 X1.CGND@2
N$21
  Top 0.152: C26.1 24.26,12.32 U20.17
N$22
  Top 0.152: U20.14 26.29,9.4 27.56,9.4 C25.1 27.56,9.53 28.32,10.29 28.32,11.05 28.7,11.43 R22.2
N$26  (via drill 0.33)
  Top 0.152: 25.15,9.4 25.15,10.67 22.35,10.67 21.34,11.68 21.34,12.32 U20.23 | v27.69,8.13 29.34,8.13 29.34,8.38 29.59,8.64 30.48,8.64 U21.38 | v13.72,10.54 13.72,10.92 9.65,10.92 9.4,10.67 9.4,6.48 4.83,6.48 2.92,8.38 2.92,10.03 3.81,10.03 X1.ID | v18.41,8.89 19.05,9.53 24.13,9.53 24.26,9.4 25.15,9.4 | 25.15,9.4 v25.15,9.27
  Bottom 0.152: v25.15,9.27 26.29,8.13 v27.69,8.13 | v13.72,10.54 15.37,8.89 v18.41,8.89
N$27  (via drill 0.33)
  Top 0.152: v21.72,14.35 20.32,12.95 20.32,12.45 U20.25 | v26.42,14.99 30.35,14.99 30.35,13.08 30.73,12.7 33.78,12.7 33.78,11.43 U21.34 33.91,11.43 34.29,11.43 U21.33
  Bottom 0.152: v21.72,14.35 22.35,14.99 v26.42,14.99
N$28  (via drill 0.33)
  Top 0.152: v26.29,11.43 22.1,11.43 21.84,11.68 21.84,12.32 U20.22 | v29.72,12.7 32.26,10.16 34.8,10.16 34.8,11.3 U21.32
  Bottom 0.152: v26.29,11.43 27.56,12.7 v29.72,12.7
N$29  (via drill 0.33)
  Top 0.152: v24.51,10.03 22.48,10.03 20.83,11.68 20.83,12.32 U20.24 | v29.84,9.91 30.48,9.27 U21.37
  Bottom 0.152: v24.51,10.03 24.64,9.91 v29.84,9.91
N$32
  Top 0.152: S2.1 42.42,9.53 39.24,9.53 39.24,7.49 39.5,7.24 40.51,7.24 U21.20
N$33  (via drill 0.33)
  Top 0.152: v12.83,6.6 12.83,9.78 14.73,9.78 U20.34 | v32.13,4.95 36.32,4.95 36.32,1.52 U21.8
  Bottom 0.152: v12.83,6.6 12.83,4.95 v32.13,4.95
N$54
  Top 0.152: C27.1 42.67,6.48 41.91,6.48 41.66,6.22 40.64,6.22 U21.18
N$56
  Top 0.152: R50.1 D1.C
N$57  (via drill 0.33)
  Top 0.152: U50.3 7.62,19.3 v8,18.92 | v11.56,18.92 11.81,19.18 11.81,19.81 11.94,19.94 18.8,19.94 18.8,27.56 17.53,28.83 17.02,28.83 L1.2
  Bottom 0.152: v11.56,18.92 v8,18.92
N$58  (via drill 0.33)
  Top 0.152: v6.22,18.92 6.22,19.43 6.6,19.81 U50.1 | v9.78,20.19 10.67,20.19 C54.1
  Bottom 0.152: v6.22,18.92 7.49,20.19 v9.78,20.19
P2_1  (via drill 0.33)
  Top 0.152: PROG.4 22.99,27.43 22.99,26.92 23.11,26.8 30.1,26.8 v30.1,26.16 | v33.66,22.61 36.45,22.61 38.86,25.02 41.02,25.02 41.02,26.8 U30.P2_1
  Bottom 0.152: v33.66,22.61 v30.1,26.16
P2_2  (via drill 0.33)
  Top 0.152: PROG.3 30.35,27.43 30.35,28.45 30.73,28.83 v33.66,28.83 | v36.7,28.83 42.16,28.83 42.16,26.92 U30.P2_2
  Bottom 0.152: v36.7,28.83 v33.66,28.83
RESET
  Top 0.152: PROG.7 33.91,29.97 33.91,32.38 34.54,33.02 42.29,33.02 42.29,32.38 46.1,28.57 46.74,28.57 46.74,22.86 39.88,16 39.88,14.86 U30.RESET
TEENSY0RX1  (via drill 0.33)
  Top 0.152: v13.72,7.49 14.73,7.49 U20.39 | v33.02,16.89 33.4,16.51 33.4,14.86 U30.P0_4
  Bottom 0.152: v13.72,7.49 14.48,8.26 21.34,8.26 29.97,16.89 v33.02,16.89
TEENSY1TX1  (via drill 0.33)
  Top 0.152: v16.76,7.11 16.76,6.99 14.86,6.99 U20.40 | v33.91,16.89 33.27,17.53 32.38,17.53 32.38,14.86 U30.P0_5
  Bottom 0.152: v16.76,7.11 17.53,7.87 21.46,7.87 26.92,13.34 30.35,13.34 v33.91,16.89
TEENSY3V3
  Top 0.254: C21.1 11.05,0.89 11.05,1.91 C22.1 11.05,2.03 11.05,3.05 | 11.05,3.05 11.05,4.19 | 11.05,3.05 C23.1 | 11.05,4.19 11.05,4.95 12.83,4.95 13.08,4.7 13.08,2.92 14.73,2.92 U20.48 14.86,2.92 17.78,2.92 17.78,12.32 U20.30 17.78,12.45 17.78,12.95 19.81,14.99 22.35,14.99 | 11.05,4.19 C24.1 | 16.76,19.18 15.62,19.18 C40.1 | 16.76,19.18 17.91,19.18 | 16.76,19.18 R41.2 | 17.91,19.18 19.05,19.18 | 17.91,19.18 R40.2 | 22.35,14.1 22.35,13.08 22.23,12.95 22.23,12.45 U20.21 | 22.35,14.1 22.35,14.99 | 22.35,14.99 22.35,16.51 U40.8 22.35,16.64 22.35,18.8 21.21,18.8 U40.3 21.08,18.8 20.57,18.8 20.32,19.05 20.32,19.18 | 20.32,19.18 19.05,19.18 | 19.05,19.18 C41.1 | 20.32,19.18 20.32,25.91 PROG.2 | U30.AVDD1 44.7,26.8 43.56,26.8 U30.AVDD2 43.43,26.92 43.05,27.3 43.05,28.45 42.04,29.46 35.94,29.46 | 35.81,30.73 35.81,29.46 C30.2 35.94,29.46 | 35.81,30.73 35.81,31.88 C32.1 | 35.81,30.73 C31.2 | 35.94,29.46 35.94,26.92 U30.VDD_USB 35.94,26.8 35.56,26.42 35.56,25.27 33.53,23.24 30.61,23.24 30.61,18.29 30.1,17.78 28.83,17.78 U30.DVDD 28.7,17.65 28.7,17.27 25.78,17.27 | U21.42 30.61,6.6 30.61,6.22 U21.43 30.48,6.22 27.05,6.22 | 26.99,5.78 26.92,5.84 26.29,5.84 U20.7 | 26.99,5.78 27.05,5.71 27.05,3.94 26.29,3.94 U20.3 | 26.99,8.7 27.05,8.64 27.05,6.22 | 26.99,8.7 26.92,8.76 26.92,8.89 26.29,8.89 U20.13 | 27.05,6.22 27.05,5.84 26.99,5.78 | 25.78,17.27 25.15,17.27 U40.13 | 25.84,14.67 25.78,14.73 25.78,17.27 | 25.84,14.67 27.56,12.95 28.7,12.95 R22.1 28.7,12.83 29.46,12.06 29.46,11.05 29.21,10.79 29.21,8.76 27.05,8.76 26.99,8.7 | 22.35,14.1 25.78,14.1 25.78,14.61 25.84,14.67
TEENSY18SDA  (via drill 0.33)
  Top 0.152: v22.1,19.43 21.97,19.56 21.97,20.45 U40.24 | v18.16,17.02 17.91,17.27 R40.1 | v16.76,10.92 16.76,8 14.86,8 U20.38 | v36.83,9.91 36.83,1.52 U21.9
  Bottom 0.152: v16.76,10.92 18.16,12.32 v18.16,17.02 18.67,17.53 20.19,17.53 v22.1,19.43 22.73,18.8 32.89,18.8 36.83,14.86 v36.83,9.91
TEENSY19SCL  (via drill 0.33)
  Top 0.152: v22.99,19.43 22.48,19.94 22.48,20.45 U40.23 | v20.07,18.41 19.68,18.41 19.56,18.54 16.76,18.54 R41.1 16.76,17.53 v16.26,17.02 | v16.13,11.56 16.13,8.51 14.86,8.51 U20.37 | v40.01,12.19 40.01,11.56 37.47,9.02 37.47,1.65 37.34,1.52 U21.10
  Bottom 0.152: v20.07,18.41 21.72,20.07 22.35,20.07 v22.99,19.43 32.77,19.43 v40.01,12.19 | v16.13,11.56 16.13,17.02 v16.26,17.02
TEENSYVIN  (via drill 0.33)
  Top 0.152: v7.11,18.92 7.11,19.81 U50.2 | 12.57,18.29 v9.78,18.29 | 12.57,18.29 C55.1 12.57,19.18 14.48,19.18 R56.2 | 12.57,18.29 12.57,17.65 12.7,17.53 C20.2 | v19.3,8.89 19.94,8.26 19.94,6.48 26.16,6.48 U20.8
  Bottom 0.152: v7.11,18.92 7.75,18.29 v9.78,18.29 10.67,18.29 10.67,16.13 16.51,10.29 17.91,10.29 v19.3,8.89
USBVCC
  Top 0.152: 6.35,13.08 7.62,13.08 U51.4 | 5.21,13.97 6.1,13.08 6.35,13.08 | 6.35,13.08 D1.A | 5.21,13.97 5.21,12.19 3.94,12.19 X1.VBUS | 5.21,13.97 C50.1
UVLO  (via drill 0.33)
  Top 0.152: v9.27,23.5 8.38,23.5 8.13,23.24 8.13,22.86 U50.7 | v10.29,24.38 11.94,24.38 R54.1 | R55.2 12.19,22.61 11.94,22.86 R54.1 | R54.1 C53.2
  Bottom 0.152: v9.27,23.5 10.16,24.38 v10.29,24.38
VBATT  (via drill 0.33)
  Top 0.152: U50.5 8.64,19.81 8.64,17.91 7.87,17.14 C51.1 7.75,17.14 7.75,15.75 U51.3 7.62,15.62 7.37,15.37 v7.37,14.48 | 5.59,27.18 C52.1 5.59,28.32 8.51,31.24 9.14,31.24 9.27,31.37 11.81,31.37 11.81,28.83 JP1.2 11.94,28.7 R54.2 C53.1 13.21,26.67 17.02,26.67 L1.1 | 5.59,27.18 5.59,26.67 | 5.59,26.67 5.59,26.42 R52.2 5.59,26.67 | 5.59,26.67 R53.2 | v4.95,16.89 1.27,20.57 1.27,23.62 0.76,24.13 0.76,24.89 3.05,27.18 5.59,27.18
  Bottom 0.152: v4.95,16.89 v7.37,14.48